# EAGLE design Battery Buddy v1_0 RevC (EAGLE 5.10)
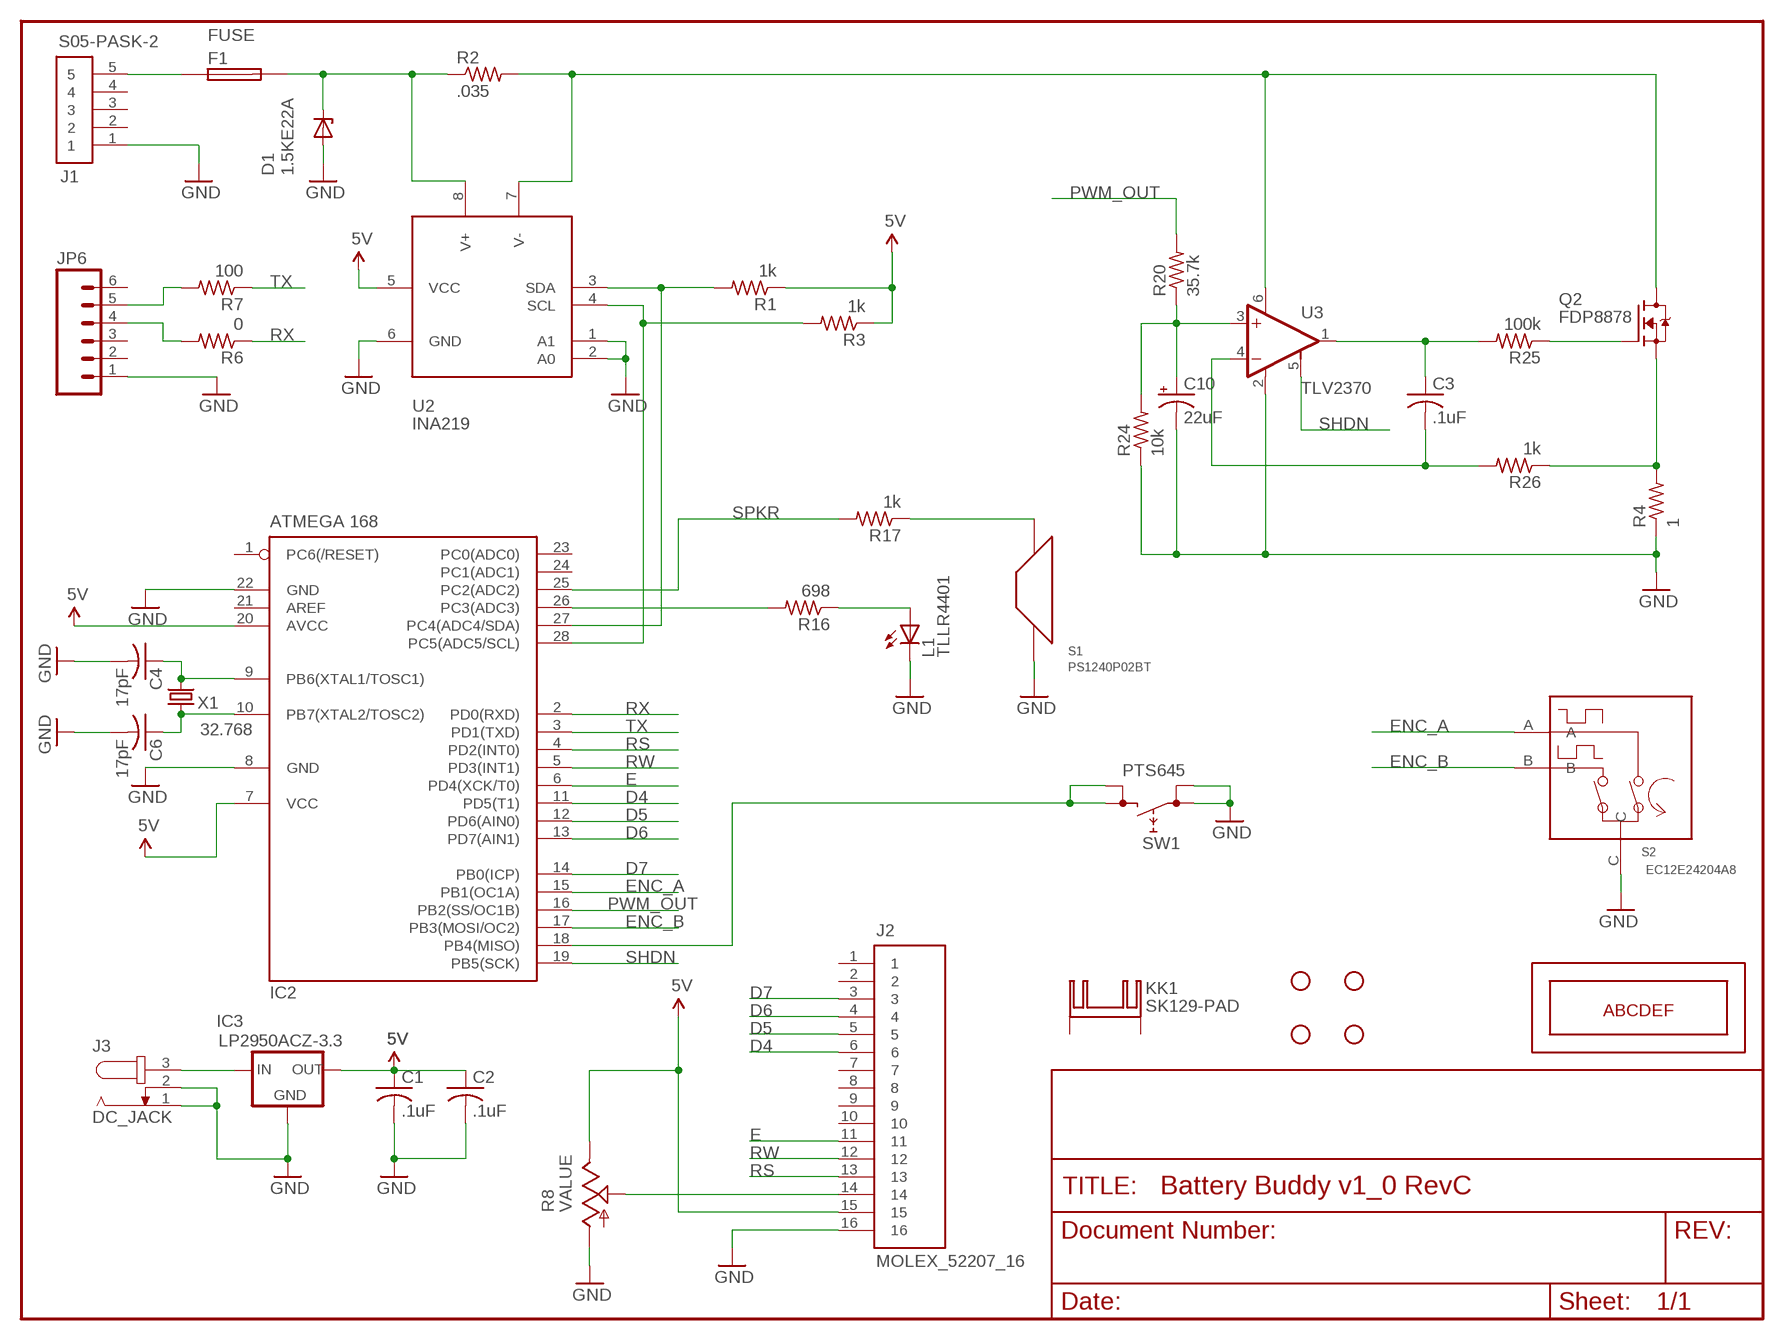
[diagram p0: schematic, sheet 1]

## Parts
C1  .1uF  C-USC0805  [C0805]
C2  .1uF  C-USC0805  [C0805]
C3  .1uF  C-USC0805  [C0805]
C4  17pF  C-USC0805  [C0805]
C6  17pF  C-USC0805  [C0805]
C10  22uF  CPOL-USA/3216-18R  [A/3216-18R]
D1  1.5KE22A  1.5KE6V8A  [DO201-15]
F1  FUSE  111501_FUSE_HOLDER  [111501_FUSE_HOLDER]
IC2  ATMEGA 168  MEGA8-P  [DIL28-3]
IC3  LP2950ACZ-3.3  [TO92]
J1  S05-PASK-2  [S05-PASK-2]
J2  MOLEX_52207_16  [MOLEX_52207_16]
J3  DC_JACK  [SPC4077]
JP2  STAND-OFF  [STAND-OFF]
JP3  STAND-OFF  [STAND-OFF]
JP4  STAND-OFF  [STAND-OFF]
JP5  STAND-OFF  [STAND-OFF]
JP6  M06SIP  [1X06]
KK1  SK129-PAD  [SK129]
L1  TLLR4401  [TLLR4401]
Q2  FDP8878  [TO220V]
R1  1k  R-US_R0805  [R0805]
R2  .035  R-US_R2010  [R2010]
R3  1k  R-US_R0805  [R0805]
R4  1  R-US_R2010  [R2010]
R6  0  R-US_R0805  [R0805]
R7  100  R-US_R0805  [R0805]
R8  50k  3306P  [3306P]
R16  698  R-US_R0805  [R0805]
R17  1k  R-US_R0805  [R0805]
R20  35.7k  R-US_R0805  [R0805]
R24  10k  R-US_R0805  [R0805]
R25  100k  R-US_R0805  [R0805]
R26  1k  R-US_R0805  [R0805]
S1  PS1240P02BT  [PS1240P02BT]
S2  EC12E24204A8  [EC12E24204A8]
SW1  PTS645  [PTS645SL]
U2  INA219  [SO08]
U3  TLV2370  [SOT23-6]
U$1  HANTRONIX_HDM16216L  [HANTRONIX_HDM16216L]
X1  32.768  CRYSTAL  [AB38T]

## Nets
5V: C1.1 C2.1 IC2.7(VCC) IC2.20(AVCC) IC3.1(OUT) J2.15 R1.1 R3.1 R8.1 U2.5(VCC)
D4: IC2.11(PD5(T1)) J2.6
D5: IC2.12(PD6(AIN0)) J2.5
D6: IC2.13(PD7(AIN1)) J2.4
D7: IC2.14(PB0(ICP)) J2.3
E: IC2.6(PD4(XCK/T0)) J2.11
ENC_A: IC2.15(PB1(OC1A)) S2.A
ENC_B: IC2.17(PB3(MOSI/OC2)) S2.B
GND: C1.2 C2.2 C4.2 C6.2 C10.- D1.A IC2.8(GND) IC2.22(GND) IC3.2(GND) J1.1 J2.16 J3.1 J3.2 JP6.1 L1.CATHODE(C) R4.1 R8.3 R24.1 S1.2 S2.C SW1.1 SW1.2 U2.1(A1) U2.2(A0) U2.6(GND) U3.2(V-)
N$1: C3.1 R25.2 U3.1(OUT)
N$2: IC3.3(IN) J3.3
N$3: C3.2 R26.2 U3.4(-IN)
N$4: Q2.1(G) R25.1
N$5: Q2.3(S) R4.2 R26.1
N$6: F1.1(A) J1.5
N$7: D1.C F1.3(B) R2.1 U2.8(V+)
N$8: IC2.28(PC5(ADC5/SCL)) R3.2 U2.4(SCL)
N$10: IC2.26(PC3(ADC3)) R16.2
N$12: R17.1 S1.1
N$13: J2.14 R8.2
N$15: IC2.27(PC4(ADC4/SDA)) R1.2 U2.3(SDA)
N$16: C10.+ R20.1 R24.2 U3.3(+IN)
N$17: C4.1 IC2.9(PB6(XTAL1/TOSC1)) X1.P$2
N$20: L1.ANODE(A) R16.1
N$22: C6.1 IC2.10(PB7(XTAL2/TOSC2)) X1.P$1
N$23: JP6.5 R7.2
N$24: JP6.4 R6.2
N$25: Q2.2(D) R2.2 U2.7(V-) U3.6(V+)
N$29: IC2.18(PB4(MISO)) SW1.4
PWM_OUT: IC2.16(PB2(SS/OC1B)) R20.2
RS: IC2.4(PD2(INT0)) J2.13
RW: IC2.5(PD3(INT1)) J2.12
RX: IC2.2(PD0(RXD)) R6.1
SHDN: IC2.19(PB5(SCK)) U3.5(SHDN)
SPKR: IC2.25(PC2(ADC2)) R17.2
TX: IC2.3(PD1(TXD)) R7.1
Unconnected: F1.2(A) F1.4(B) IC2.1(PC6(/RESET)) IC2.21(AREF) IC2.23(PC0(ADC0)) IC2.24(PC1(ADC1)) J1.2 J1.3 J1.4 J2.1 J2.2 J2.7 J2.8 J2.9 J2.10 JP6.2 JP6.3 JP6.6 KK1.A2,5(K) KK1.B2,5(K) SW1.3

## Library data of the parts
C1-C4 C6 = resistor:C-US: CAPACITOR, American symbol
C10 = resistor:CPOL-US: POLARIZED CAPACITOR, American symbol
D1 = custom:1.5KE6V8A
F1 = custom:111501_FUSE_HOLDER
IC2 = atmel:MEGA8-P: MICROCONTROLLER 8 Kbytes FLASH, 1 kbytes SRAM, 512 bytes EEPROM, USART, 4-channel 10 bit ADC, 2-channel 8 bit ADC Pin compatible with Atmega48, ATMega88, ATMega168 Source: avr.lbr
IC3 = v-reg:LP2950?*: Source: http://cache.national.com/ds/LP/LP2950.pdf
J1 = custom:S05-PASK-2
J2 = custom:MOLEX_52207_16
J3 = custom:DC_JACK
JP2-JP5 = SparkFun:STAND-OFF: Stand Off This is the mechanical footprint for a #4 phillips button head screw. Use the keepout ring to avoid running the screw head into surrounding components. SKU : PRT-00447
JP6 = SparkFun:M06: Header 6 Standard 6-pin 0.1" header. Use with straight break away headers (SKU : PRT-00116), right angle break away headers (PRT-00553), swiss pins (PRT-00743), machine pins (PRT-00117), and female headers (PRT-00115). Molex polarized connector foot print use with SKU : PRT-08094 with associated crimp pins and housings. NOTES ON THE VARIANTS LOCK and LOCK_LONGPADS... This footprint was designed to help hold the alignment of a through-hole component (i.e. 6-pin header) while soldering it into place. You may notice that each hole has been shifted either up or down by 0.005 of an inch from it's more standard position (which is a perfectly straight line). This slight alteration caused the pins (the squares in the middle) to touch the edges of the holes. Because they are alternating, it causes a "brace" to hold the component in place. 0.005 has proven to be the perfect amount of "off-center" position when using our standard breakaway headers. Although looks a little odd when you look at the bare footprint, once you have a header in there, the alteration is very hard to notice. Also, if you push a header all the way into place, it is covered up entirely on the bottom side. This idea of altering the position of holes to aid alignment will be further integrated into the Sparkfun Library for other footprints. It can help hold any component with 3 or more connection pins.
KK1 = heatsink:SK129-PAD: HEATSINK manufacturer Fischer/distributor Buerklin
L1 = custom:TLLR4401
Q2 = custom:FDP8878
R1-R4 R6 R7 R16 R17 R20 R24-R26 = resistor:R-US_: RESISTOR, American symbol
R8 = custom:3306P
S1 = custom:PS1240P02BT
S2 = custom:EC12E24204A8
SW1 = custom:PTS645
U2 = custom:INA219
U3 = custom:TLV2370
U$1 = custom:HANTRONIX_HDM16216L
X1 = custom:CRYSTAL

## Board
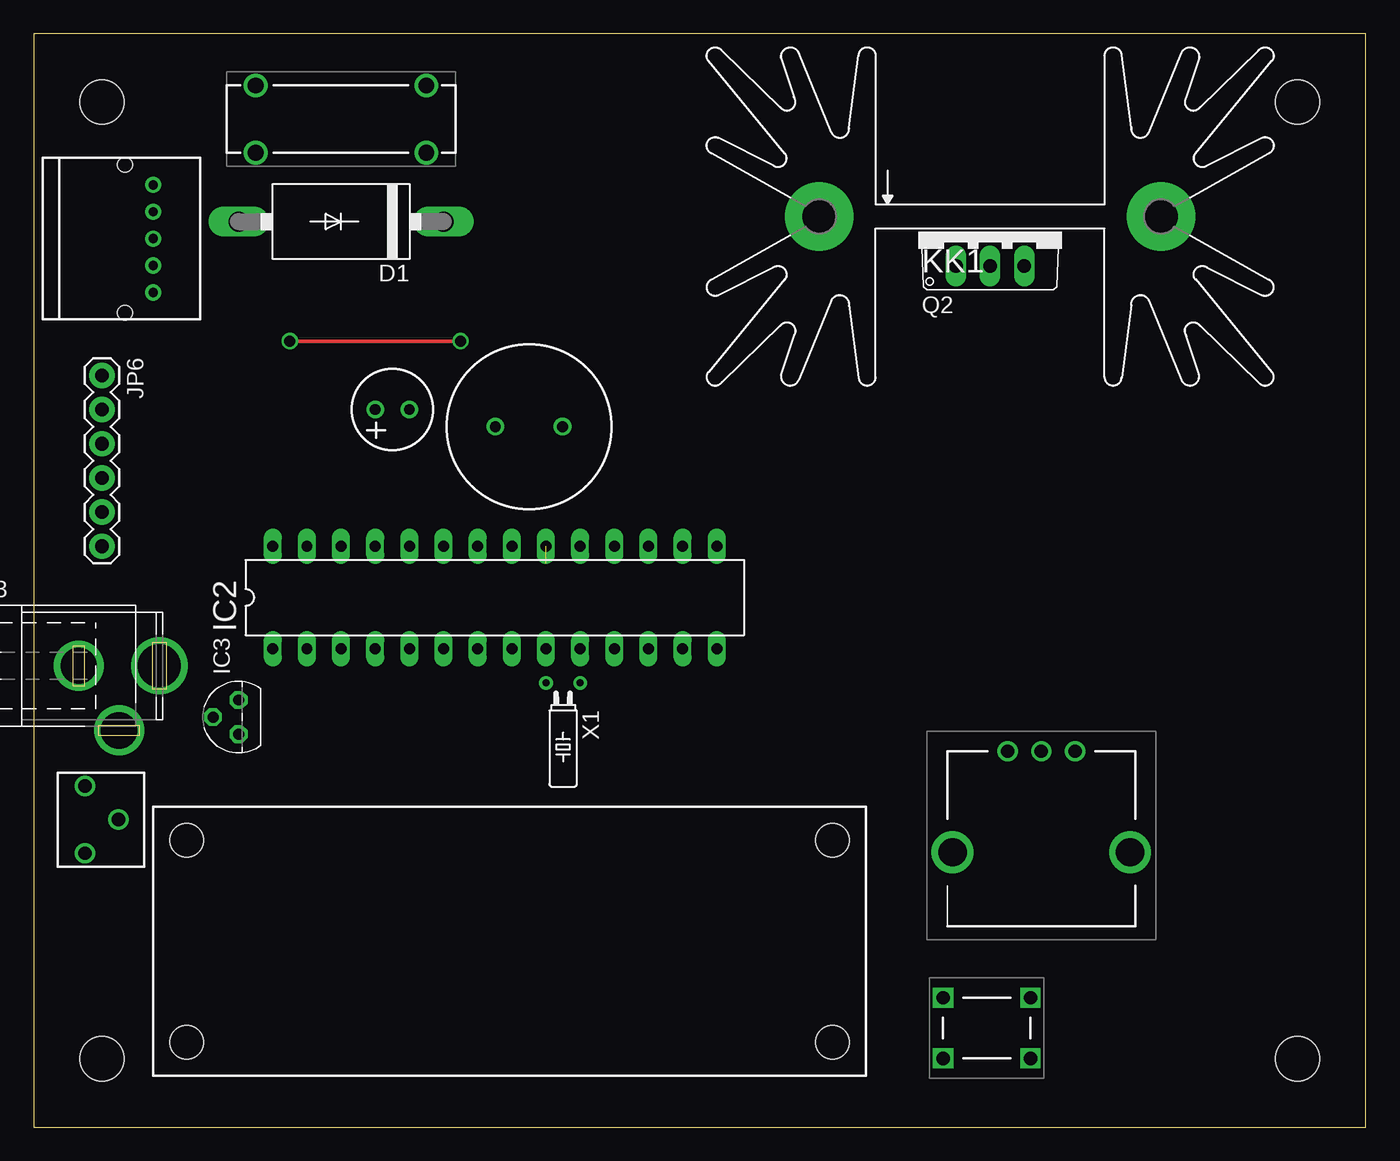
[diagram p1: board, top side]
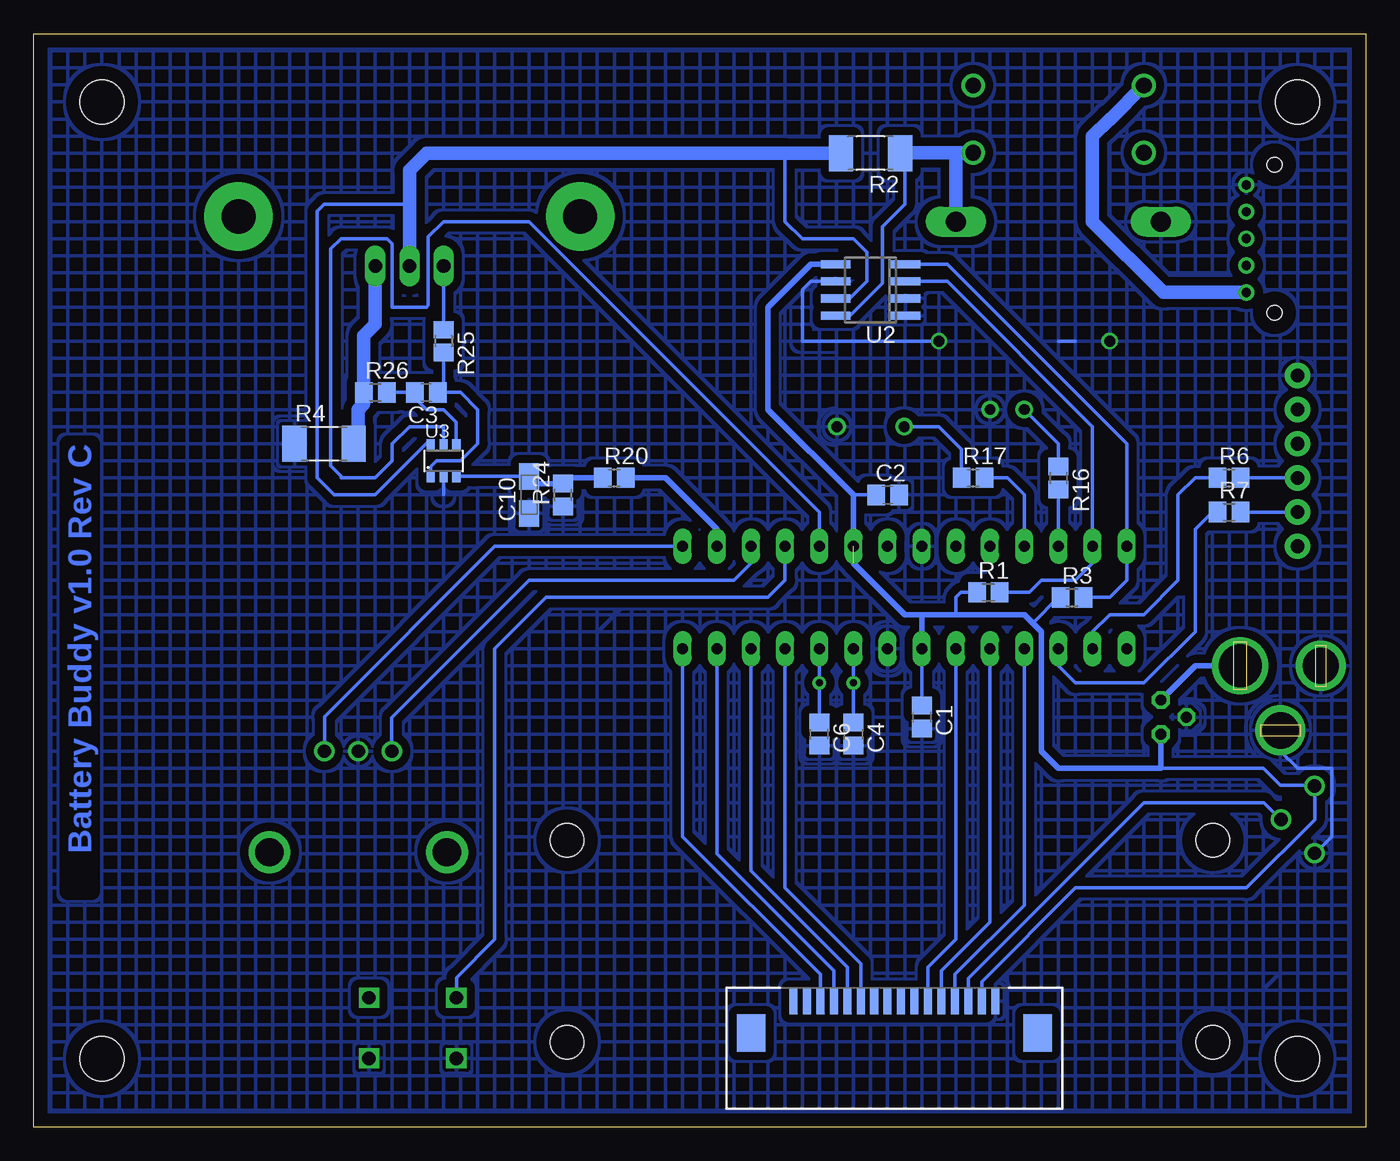
[diagram p2: board, bottom side, seen from below]

Size 99.06 x 81.28 mm. Coordinates in mm from the lower left corner, seen from the top.
Outline: 0,0 99.06,0 99.06,81.28 0,81.28 0,0
Copper layers (1*16): Top 0.035mm / dielectric 1.5mm / Bottom 0.035mm
Design rules "default": minimum track width 10mil, minimum drill 24mil, track to track 8mil, track to pad 8mil, pad to pad 8mil, via to via 8mil, smd to smd 8mil, copper to edge 40mil, drill to drill 8mil, minimum pad ring 10mil, minimum via ring 8mil, stop-mask expansion 4mil, vias tented up to drill 0mil, thermal gap 10mil

### Footprints (pad centres in the part's own frame; a part is rotated, then mirrored left to right if it is on the bottom)
C0805 = smd 1.3 x 1.5: 1 -0.85,0; 2 0.85,0
A/3216-18R = smd 1.95 x 1.5: + 1.375,0; - -1.375,0
DO201-15 = drill 1.499 long: A 7.62,0; C -7.62,0
111501_FUSE_HOLDER = drill 1.17 round: 1 -6.35,2.5; 2 -6.35,-2.5; 3 6.35,-2.5; 4 6.35,2.5
DIL28-3 = drill 0.813 long: 1 -16.51,-3.81; 2 -13.97,-3.81; 3 -11.43,-3.81; 4 -8.89,-3.81; 5 -6.35,-3.81; 6 -3.81,-3.81; 7 -1.27,-3.81; 8 1.27,-3.81; 9 3.81,-3.81; 10 6.35,-3.81; 11 8.89,-3.81; 12 11.43,-3.81; 13 13.97,-3.81; 14 16.51,-3.81; 15 16.51,3.81; 16 13.97,3.81; 17 11.43,3.81; 18 8.89,3.81; 19 6.35,3.81; 20 3.81,3.81; 21 1.27,3.81; 22 -1.27,3.81; 23 -3.81,3.81; 24 -6.35,3.81; 25 -8.89,3.81; 26 -11.43,3.81; 27 -13.97,3.81; 28 -16.51,3.81
TO92 = drill 0.813 octagon: 1 -1.27,0; 2 0,1.905; 3 1.27,0
S05-PASK-2 = drill 0.7 round: 1 4,0; 2 2,0; 3 0,0; 4 -2,0; 5 -4,0 | hole 1.1: 5.5,2.1; -5.5,2.1
MOLEX_52207_16 = smd 0.6 x 1.9: 1 -7,3; 2 -6,3; 3 -5,3; 4 -4,3; 5 -3,3; 6 -2,3; 7 -1,3; 8 0,3; 9 1,3; 10 2,3; 11 3,3; 12 4,3; 13 5,3; 14 6,3; 15 7,3; 16 8,3 | smd 2.1 x 2.8: P$17 -10.15,0.65; P$18 11.15,0.65
SPC4077 = drill 2.7 round: 1 -3,0; 2 0,-4.8 | drill 3.2 round: 3 3,0
STAND-OFF = hole 3.302: 0,0
1X06 = drill 1.016 pad 1.88 round: 1 0,0; 2 2.54,0; 3 5.08,0; 4 7.62,0; 5 10.16,0; 6 12.7,0
SK129 = drill 2.54 pad 5.08 round: A2,5 -12.7,-0.889; B2,5 12.7,-0.889
TLLR4401 = drill 0.8 round: ANODE 0,1.27; CATHODE 0,-1.27
TO220V = drill 1.016 long: 1 -2.54,-2.54; 2 0,-2.54; 3 2.54,-2.54
R0805 = smd 1.3 x 1.5: 1 -0.85,0; 2 0.85,0
R2010 = smd 1.8 x 2.7: 1 -2.2,0; 2 2.2,0
3306P = drill 1 round: 1 -2.5,0; 2 0,2.5; 3 2.5,0
PS1240P02BT = drill 0.8 round: 1 -2.5,0; 2 2.5,0
EC12E24204A8 = drill 1 round: A -2.5,0; B 2.5,0; C 0,0 | drill 2.1 round: P$1 -6.6,7.5; P$2 6.6,7.5
PTS645SL = drill 1 square: 1 -3.5,-2.5; 2 3,-2.5; 3 3,2; 4 -3.5,2
SO08 = smd 0.6 x 2.2: 1 -1.905,-2.6; 2 -0.635,-2.6; 3 0.635,-2.6; 4 1.905,-2.6; 5 1.905,2.6; 6 0.635,2.6; 7 -0.635,2.6; 8 -1.905,2.6
SOT23-6 = smd 0.6 x 0.9: 1 -0.95,-1.15; 2 0,-1.15; 3 0.95,-1.15; 4 0.95,1.15; 5 0,1.15; 6 -0.95,1.15
HANTRONIX_HDM16216L = hole 2.5: 2.5,2.5; 2.5,17.5; 50.5,17.5; 50.5,2.5
AB38T = drill 0.508 round: P$1 -1.27,0; P$2 1.27,0

### Placement (x,y rotation side)
C1  33.02,30.48 270 bottom
C2  35.56,46.99 0 bottom
C3  69.85,54.61 180 bottom
C4  38.1,29.21 270 bottom
C6  40.64,29.21 270 bottom
C10  62.23,46.99 90 bottom
D1  22.86,67.31 180 top
F1  22.86,74.93 0 top
IC2  34.29,39.37 0 top
IC3  15.24,30.48 90 top
J1  8.89,66.04 90 top
J2  35.56,6.35 0 bottom
J3  6.35,34.29 0 top
JP2  5.08,5.08 0 top
JP3  93.98,5.08 0 top
JP4  5.08,76.2 0 top
JP5  93.98,76.2 0 top
JP6  5.08,55.88 270 top
KK1  71.12,68.58 0 top
L1  26.67,53.34 90 top
Q2  71.12,66.55 0 top
R1  28.07,39.75 0 bottom
R2  36.83,72.39 180 bottom
R3  21.84,39.37 0 bottom
R4  77.47,50.8 0 bottom
R6  10.16,48.26 0 bottom
R7  10.16,45.72 0 bottom
R8  3.81,22.86 270 top
R16  22.86,48.26 270 bottom
R17  29.21,48.26 0 bottom
R20  55.88,48.26 0 bottom
R24  59.69,46.99 90 bottom
R25  68.58,58.42 270 bottom
R26  73.66,54.61 0 bottom
S1  36.83,52.07 0 top
S2  74.93,27.94 180 top
SW1  71.12,7.62 0 top
U2  36.83,62.23 90 bottom
U3  68.58,49.53 0 bottom
U$1  8.89,3.81 0 top
X1  39.37,33.02 180 top

### Tracks (layer width: path | path; a pad name or v marks a point on that pad's centre or on a via)
5V  (1 unrouted)
  Bottom 0.254: J2.15 28.56,10.81 21.59,17.78 8.89,17.78 3.81,22.86 R8.1 3.85,25.4 6.35,25.4 7.62,26.67 15.24,26.67 | 33.02,36.83 IC2.7 C1.1 | 38.1,46.99 C2.1 | R3.1 22.86,39.37 24.77,37.47 | R1.1 30.1,39.75 30.48,39.37 30.48,38.1
  Bottom 0.406: 38.1,41.91 34.29,38.1 33.02,38.1 | 33.02,38.1 IC2.7 | IC2.20 38.1,46.99 44.45,53.34 44.45,60.96 41.27,64.14 U2.5 | IC3.1 15.24,26.67 22.86,26.67 24.13,27.94 24.13,36.83 24.77,37.47 25.4,38.1 30.48,38.1 33.02,38.1
D4
  Bottom 0.254: J2.6 37.56,12.16 43.18,17.78 IC2.11
D5
  Bottom 0.254: J2.5 38.56,11.89 45.72,19.05 IC2.12
D6
  Bottom 0.254: J2.4 39.56,11.62 48.26,20.32 IC2.13
D7
  Bottom 0.254: J2.3 40.56,11.35 50.8,21.59 IC2.14
E
  Bottom 0.254: J2.11 32.56,11.89 30.48,13.97 IC2.6
ENC_A
  Bottom 0.254: S2.A 77.43,30.52 64.77,43.18 IC2.15
ENC_B
  Bottom 0.254: S2.B 72.43,30.44 62.23,40.64 46.99,40.64 45.72,41.91 IC2.17
GND  (via drill 0.81)
  Top 0.254: v19.05,58.42 v31.75,58.42
  Bottom 0.254: 68.58,46.99 U3.2 | 21.59,58.42 22.86,58.42 | U2.6 41.27,62.87 41.91,62.23 41.91,58.42 v31.75,58.42 | R8.3 3.77,20.36 2.54,21.59 2.54,26.67 5.08,26.67 6.35,27.94
  pour Bottom (isolate 0.61, hatched): 0,81.28 99.06,81.28 99.06,0 0,0
N$1
  Bottom 0.254: R25.2 68.58,55.03 C3.1 67.31,54.61 66.04,53.34 66.04,50.8 67.31,49.53 69.09,49.53 69.53,49.09 U3.1
N$2
  Bottom 0.406: IC3.3 12.7,34.29 J3.3
N$3
  Bottom 0.254: C3.2 71.12,55.03 | C3.2 70.7,55.03 | 71.12,54.61 C3.2 | 71.12,54.61 R26.2 | U3.4 67.63,52.39 68.58,53.34 69.85,53.34 71.12,54.61
N$4
  Bottom 0.254: R25.1 Q2.1
N$5
  Bottom 1.016: Q2.3 73.66,59.69 74.51,58.84 R26.1 74.51,53.76 74.93,53.34 74.93,51.14 R4.2
N$6
  Bottom 1.016: J1.5 15.05,62.04 20.32,67.31 20.32,73.66 19.05,74.93 19.01,74.93 F1.1
N$7
  Bottom 0.254: U2.8 38.35,60.33 35.94,62.74 35.94,66.93 34.29,68.58 34.29,72.05 R2.1
  Bottom 1.016: 30.48,72.43 34.59,72.43 R2.1 | 30.48,72.43 F1.3 | D1.C 30.48,72.43
N$8
  Bottom 0.254: U2.4 31.11,64.14 17.78,50.8 IC2.28 17.78,40.64 19.05,39.37 R3.2
N$9  (via drill 0.51)
  other vias: 5.08,76.2
N$10
  Bottom 0.254: IC2.26 R16.2
N$12
  Bottom 0.254: R17.1 30.06,50.38 31.75,52.07 S1.1
N$13
  Bottom 0.254: J2.14 29.56,11.08 16.51,24.13 7.58,24.13 R8.2
N$14
  pour Bottom (isolate 0.61, hatched): 39.37,77.47 39.37,38.1 86.36,38.1 86.36,77.47
N$15
  Bottom 0.254: U2.3 31.11,62.87 20.32,52.07 IC2.27 20.32,41.91 21.59,40.64 24.13,40.64 25.02,39.75 R1.2
N$16
  Bottom 0.254: C10.+ 66.34,48.37 66.36,48.38 U3.3
  Bottom 0.406: R20.1 59.27,48.26 R24.2 61.7,47.84 C10.+
N$17
  Bottom 0.254: IC2.9 X1.P$2 C4.1
N$20
  Bottom 0.254: R16.1 22.86,50.8 L1.ANODE
N$21
  pour Bottom (isolate 0.61, hatched): 6.35,39.37 6.35,11.43 7.62,10.16 57.15,10.16 57.15,36.83 54.61,39.37
N$22
  Bottom 0.254: IC2.10 X1.P$1 C6.1
N$23
  Bottom 0.254: JP6.5 R7.2
N$24
  Bottom 0.254: JP6.4 R6.2
N$25
  Bottom 0.254: U2.7 38.35,61.59 37.08,62.87 37.08,65.02 38.1,66.04 41.91,66.04 43.18,67.31 43.18,72.39 | 69.65,50.8 U3.6 69.53,50.86 69.79,50.86 73.66,46.99 76.71,46.99 77.98,48.26 77.98,68.07 77.47,68.58 71.12,68.58
  Bottom 1.016: R2.2 43.18,72.39 69.85,72.39 71.12,71.12 71.12,68.58 Q2.2
N$26  (via drill 0.51)
  other vias: 5.08,5.08
N$27  (via drill 0.51)
  other vias: 93.98,5.08
N$28  (via drill 0.51)
  other vias: 93.98,76.2
N$29
  Bottom 0.254: SW1.4 67.62,11.12 64.77,13.97 64.77,35.56 60.96,39.37 44.45,39.37 43.18,40.64 IC2.18
PWM_OUT
  Bottom 0.406: IC2.16 48.26,44.45 52.07,48.26 R20.2
RS
  Bottom 0.254: J2.13 30.56,11.35 25.4,16.51 IC2.4
RW
  Bottom 0.254: J2.12 31.56,11.62 27.94,15.24 IC2.5
RX
  Bottom 0.254: IC2.2 20.32,36.83 19.05,38.1 16.51,38.1 13.97,40.64 13.97,46.99 12.7,48.26 R6.1
SHDN
  Bottom 0.254: U3.5 68.58,52.07 71.12,52.07 72.39,50.8 72.39,49.53 73.66,48.26 76.2,48.26 76.2,48.39 76.96,49.15 76.96,65.28 76.2,66.04 72.77,66.04 72.39,65.66 72.39,60.96 69.85,60.96 69.72,61.09 69.72,66.17 68.58,67.31 62.23,67.31 40.64,45.72 IC2.19
SPKR
  Bottom 0.254: R17.2 26.67,48.26 25.4,46.99 IC2.25
TX
  Bottom 0.254: IC2.3 22.86,34.29 21.59,33.02 16.51,33.02 12.7,36.83 12.7,44.45 11.43,45.72 R7.1

### Text on the board
Bottom: Battery Buddy v1.0 Rev C